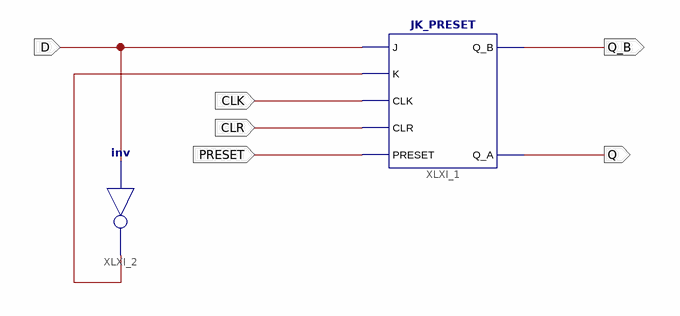
[diagram p0: schematic sheet 1]
// Xilinx ISE schematic D_FF_PRESET.sch (artix7) as structural Verilog: 2 symbols, 6 ports
module D_FF_PRESET (
  input  D,
  input  CLK,
  input  CLR,
  input  PRESET,
  output Q_B,
  output Q
);

  wire XLXN_8;

  JK_PRESET XLXI_1 (.J(D), .K(XLXN_8), .CLK(CLK), .CLR(CLR), .PRESET(PRESET), .Q_B(Q_B), .Q_A(Q));
  not XLXI_2 (XLXN_8, D);
endmodule
